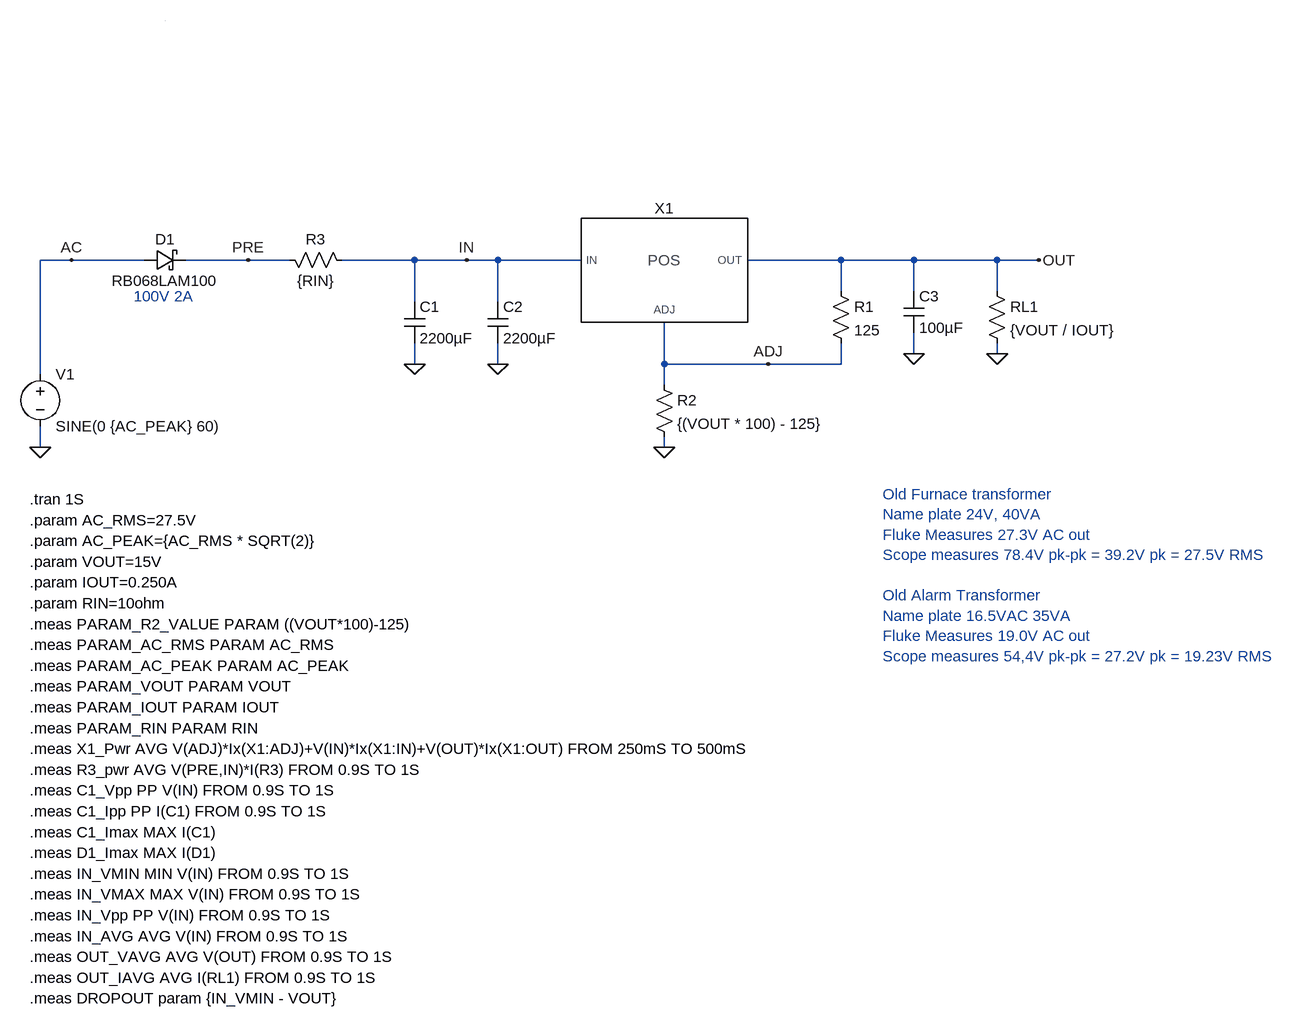
[diagram p0: schematic Parameteric Half-wave Rectifier with IdealRegulator.asc]
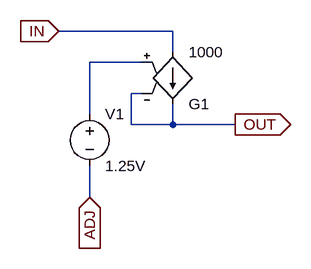
[diagram p1: sub-circuit idealposregulator.asc]
Parameteric Half-wave Rectifier with IdealRegulator.asc, the LTspice schematic file:
Version 4
SHEET 1 2092 1520
WIRE -144 368 -192 368
WIRE -32 368 -144 368
WIRE 128 368 32 368
WIRE 192 368 128 368
WIRE 384 368 272 368
WIRE 464 368 384 368
WIRE 512 368 464 368
WIRE 640 368 512 368
WIRE 1040 368 896 368
WIRE 1152 368 1040 368
WIRE 1280 368 1152 368
WIRE 1344 368 1280 368
WIRE 1040 416 1040 368
WIRE 1152 416 1152 368
WIRE 1280 416 1280 368
WIRE 384 432 384 368
WIRE 512 432 512 368
WIRE 1152 512 1152 480
WIRE 1280 512 1280 496
WIRE 384 528 384 496
WIRE 512 528 512 496
WIRE 768 528 768 464
WIRE 928 528 768 528
WIRE 1040 528 1040 496
WIRE 1040 528 928 528
WIRE -192 544 -192 368
WIRE 768 560 768 528
WIRE -192 656 -192 624
WIRE 768 656 768 640
WIRE 0 0 0 0
FLAG -192 656 0
FLAG 384 528 0
FLAG 1344 368 OUT
FLAG 768 656 0
FLAG 1152 512 0
FLAG 1280 512 0
FLAG 464 368 IN
FLAG -144 368 AC
FLAG 512 528 0
FLAG 928 528 ADJ
FLAG 128 368 PRE
SYMBOL voltage -192 528 R0
WINDOW 123 0 0 Left 0
WINDOW 39 0 0 Left 0
SYMATTR InstName V1
SYMATTR Value SINE(0 {AC_PEAK} 60)
SYMBOL schottky -32 384 R270
WINDOW 0 32 32 VTop 2
WINDOW 3 0 32 VBottom 2
SYMATTR InstName D1
SYMATTR Value RB068LAM100
SYMATTR Description Diode
SYMATTR Type diode
SYMBOL cap 368 432 R0
SYMATTR InstName C1
SYMATTR Value 2200µF
SYMBOL res 1024 400 R0
SYMATTR InstName R1
SYMATTR Value 125
SYMBOL res 752 544 R0
SYMATTR InstName R2
SYMATTR Value {(VOUT * 100) - 125}
SYMBOL cap 1136 416 R0
SYMATTR InstName C3
SYMATTR Value 100µF
SYMBOL res 1264 400 R0
SYMATTR InstName RL1
SYMATTR Value {VOUT / IOUT}
SYMBOL cap 496 432 R0
SYMATTR InstName C2
SYMATTR Value 2200µF
SYMBOL res 176 352 M90
WINDOW 0 0 56 VBottom 2
WINDOW 3 32 56 VTop 2
SYMATTR InstName R3
SYMATTR Value {RIN}
SYMBOL IdealPosRegulator 768 368 R0
SYMATTR InstName X1
TEXT -48 424 Left 2 ;100V 2A
TEXT -208 736 Left 2 !.tran 1S
TEXT -208 768 Left 2 !.param AC_RMS=27.5V
TEXT -208 800 Left 2 !.param AC_PEAK={AC_RMS * SQRT(2)}
TEXT -208 832 Left 2 !.param VOUT=15V
TEXT -208 864 Left 2 !.param IOUT=0.250A
TEXT -208 896 Left 2 !.param RIN=10ohm
TEXT -208 928 Left 2 !.meas PARAM_R2_VALUE PARAM ((VOUT*100)-125)
TEXT -208 960 Left 2 !.meas PARAM_AC_RMS PARAM AC_RMS
TEXT -208 992 Left 2 !.meas PARAM_AC_PEAK PARAM AC_PEAK
TEXT -208 1024 Left 2 !.meas PARAM_VOUT PARAM VOUT
TEXT -208 1056 Left 2 !.meas PARAM_IOUT PARAM IOUT
TEXT -208 1088 Left 2 !.meas PARAM_RIN PARAM RIN
TEXT -208 1120 Left 2 !.meas X1_Pwr AVG V(ADJ)*Ix(X1:ADJ)+V(IN)*Ix(X1:IN)+V(OUT)*Ix(X1:OUT) FROM 250mS TO 500mS
TEXT -208 1152 Left 2 !.meas R3_pwr AVG V(PRE,IN)*I(R3) FROM 0.9S TO 1S
TEXT -208 1184 Left 2 !.meas C1_Vpp PP V(IN) FROM 0.9S TO 1S
TEXT -208 1216 Left 2 !.meas C1_Ipp PP I(C1) FROM 0.9S TO 1S
TEXT -208 1248 Left 2 !.meas C1_Imax MAX I(C1)
TEXT -208 1280 Left 2 !.meas D1_Imax MAX I(D1)
TEXT -208 1312 Left 2 !.meas IN_VMIN MIN V(IN) FROM 0.9S TO 1S
TEXT -208 1344 Left 2 !.meas IN_VMAX MAX V(IN) FROM 0.9S TO 1S
TEXT -208 1376 Left 2 !.meas IN_Vpp PP V(IN) FROM 0.9S TO 1S
TEXT -208 1408 Left 2 !.meas IN_AVG AVG V(IN) FROM 0.9S TO 1S
TEXT -208 1440 Left 2 !.meas OUT_VAVG AVG V(OUT) FROM 0.9S TO 1S
TEXT -208 1472 Left 2 !.meas OUT_IAVG AVG I(RL1) FROM 0.9S TO 1S
TEXT -208 1504 Left 2 !.meas DROPOUT param {IN_VMIN - VOUT}
TEXT 1104 728 Left 2 ;Old Furnace transformer\nName plate 24V, 40VA\nFluke Measures 27.3V AC out\nScope measures 78.4V pk-pk = 39.2V pk = 27.5V RMS\n \nOld Alarm Transformer\nName plate 16.5VAC 35VA\nFluke Measures 19.0V AC out\nScope measures 54,4V pk-pk = 27.2V pk = 19.23V RMS

idealposregulator.asc, the sub-circuit schematic file:
Version 4
SHEET 1 880 680
WIRE 192 80 16 80
WIRE 192 112 192 80
WIRE 144 128 64 128
WIRE 144 176 128 176
WIRE 64 208 64 128
WIRE 128 224 128 176
WIRE 192 224 192 192
WIRE 192 224 128 224
WIRE 288 224 192 224
WIRE 64 336 64 288
FLAG 16 80 IN
IOPIN 16 80 In
FLAG 288 224 OUT
IOPIN 288 224 Out
FLAG 64 336 ADJ
IOPIN 64 336 In
SYMBOL g2 192 208 M180
SYMATTR InstName G1
SYMATTR Value 1000
SYMBOL voltage 64 192 R0
SYMATTR InstName V1
SYMATTR Value 1.25V

The netlist it stands for:
* Parameteric Half-wave Rectifier with IdealRegulator.asc
V1 AC 0 SINE(0 {AC_PEAK} 60)
D1 AC PRE RB068LAM100
C1 IN 0 2200µF
R1 OUT ADJ 125
R2 ADJ 0 {(VOUT * 100) - 125}
C3 OUT 0 100µF
RL1 OUT 0 {VOUT / IOUT}
C2 IN 0 2200µF
R3 PRE IN {RIN}
XX1 ADJ IN OUT idealposregulator

* block symbol definitions
.subckt idealposregulator ADJ IN OUT
G1 IN OUT N001 OUT 1000
V1 N001 ADJ 1.25V
.ends idealposregulator

.model D D
.lib standard.dio
* 100V 2A
.tran 1S
.param AC_RMS=27.5V
.param AC_PEAK={AC_RMS * SQRT(2)}
.param VOUT=15V
.param IOUT=0.250A
.param RIN=10ohm
.meas PARAM_R2_VALUE PARAM ((VOUT*100)-125)
.meas PARAM_AC_RMS PARAM AC_RMS
.meas PARAM_AC_PEAK PARAM AC_PEAK
.meas PARAM_VOUT PARAM VOUT
.meas PARAM_IOUT PARAM IOUT
.meas PARAM_RIN PARAM RIN
.meas X1_Pwr AVG V(ADJ)*Ix(X1:ADJ)+V(IN)*Ix(X1:IN)+V(OUT)*Ix(X1:OUT) FROM 250mS TO 500mS
.meas R3_pwr AVG V(PRE,IN)*I(R3) FROM 0.9S TO 1S
.meas C1_Vpp PP V(IN) FROM 0.9S TO 1S
.meas C1_Ipp PP I(C1) FROM 0.9S TO 1S
.meas C1_Imax MAX I(C1)
.meas D1_Imax MAX I(D1)
.meas IN_VMIN MIN V(IN) FROM 0.9S TO 1S
.meas IN_VMAX MAX V(IN) FROM 0.9S TO 1S
.meas IN_Vpp PP V(IN) FROM 0.9S TO 1S
.meas IN_AVG AVG V(IN) FROM 0.9S TO 1S
.meas OUT_VAVG AVG V(OUT) FROM 0.9S TO 1S
.meas OUT_IAVG AVG I(RL1) FROM 0.9S TO 1S
.meas DROPOUT param {IN_VMIN - VOUT}
* Old Furnace transformer
* Name plate 24V, 40VA
* Fluke Measures 27.3V AC out
* Scope measures 78.4V pk-pk = 39.2V pk = 27.5V RMS
* Old Alarm Transformer
* Name plate 16.5VAC 35VA
* Fluke Measures 19.0V AC out
* Scope measures 54,4V pk-pk = 27.2V pk = 19.23V RMS
.backanno
.end